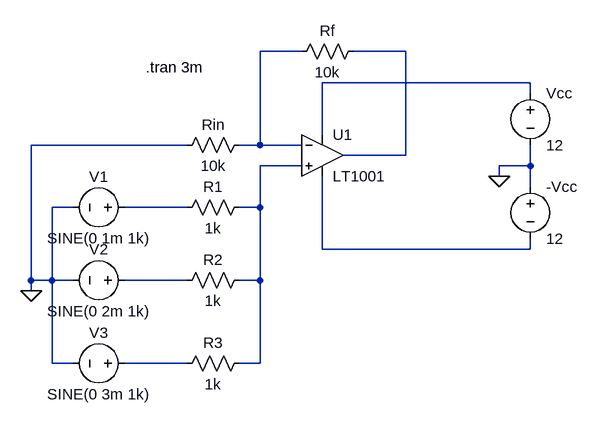
[diagram p0: schematic non_inverting_summing_amp.asc]
non_inverting_summing_amp.asc, the LTspice schematic file:
Version 4.1
SHEET 1 880 680
WIRE 144 0 80 0
WIRE 304 0 224 0
WIRE 496 48 176 48
WIRE 496 64 496 48
WIRE 176 128 176 48
WIRE -32 144 -272 144
WIRE 80 144 80 0
WIRE 80 144 48 144
WIRE 144 144 80 144
WIRE 304 160 304 0
WIRE 304 160 208 160
WIRE 144 176 80 176
WIRE 496 176 496 144
WIRE 496 176 448 176
WIRE 448 192 448 176
WIRE 496 208 496 176
WIRE -208 240 -240 240
WIRE -32 240 -128 240
WIRE 80 240 80 176
WIRE 80 240 48 240
WIRE 176 304 176 192
WIRE 496 304 496 288
WIRE 496 304 176 304
WIRE -272 352 -272 144
WIRE -240 352 -240 240
WIRE -240 352 -272 352
WIRE -208 352 -240 352
WIRE -32 352 -128 352
WIRE 80 352 80 240
WIRE 80 352 48 352
WIRE -272 368 -272 352
WIRE -240 480 -240 352
WIRE -208 480 -240 480
WIRE -32 480 -128 480
WIRE 80 480 80 352
WIRE 80 480 48 480
FLAG 448 192 0
FLAG -272 368 0
SYMBOL OpAmps\\LT1001 176 96 R0
SYMATTR InstName U1
SYMBOL voltage 496 48 R0
WINDOW 123 0 0 Left 0
WINDOW 39 0 0 Left 0
SYMATTR InstName Vcc
SYMATTR Value 12
SYMBOL voltage 496 192 R0
WINDOW 123 0 0 Left 0
WINDOW 39 0 0 Left 0
SYMATTR InstName -Vcc
SYMATTR Value 12
SYMBOL res 64 128 R90
WINDOW 0 0 56 VBottom 2
WINDOW 3 32 56 VTop 2
SYMATTR InstName Rin
SYMATTR Value 10k
SYMBOL res 240 -16 R90
WINDOW 0 0 56 VBottom 2
WINDOW 3 32 56 VTop 2
SYMATTR InstName Rf
SYMATTR Value 10k
SYMBOL voltage -112 240 R90
WINDOW 0 -32 56 VBottom 2
WINDOW 3 32 56 VTop 2
WINDOW 123 0 0 Left 0
SYMATTR InstName V1
SYMATTR Value SINE(0 1m 1k)
SYMBOL res 64 224 R90
WINDOW 0 0 56 VBottom 2
WINDOW 3 32 56 VTop 2
SYMATTR InstName R1
SYMATTR Value 1k
SYMBOL res 64 336 R90
WINDOW 0 0 56 VBottom 2
WINDOW 3 32 56 VTop 2
SYMATTR InstName R2
SYMATTR Value 1k
SYMBOL res 64 464 R90
WINDOW 0 0 56 VBottom 2
WINDOW 3 32 56 VTop 2
SYMATTR InstName R3
SYMATTR Value 1k
SYMBOL voltage -112 352 R90
WINDOW 0 -32 56 VBottom 2
WINDOW 3 32 56 VTop 2
WINDOW 123 0 0 Left 0
WINDOW 39 0 0 Left 0
SYMATTR InstName V2
SYMATTR Value SINE(0 2m 1k)
SYMBOL voltage -112 480 R90
WINDOW 0 -32 56 VBottom 2
WINDOW 3 32 56 VTop 2
WINDOW 123 0 0 Left 0
WINDOW 39 0 0 Left 0
SYMATTR InstName V3
SYMATTR Value SINE(0 3m 1k)
TEXT -96 24 Left 2 !.tran 3m

The netlist it stands for:
* non_inverting_summing_amp.asc
X§U1 N004 N001 N003 N006 N002 LT1001  ; pins In+ In- V+ V- OUT
Vcc N003 0 12
V§-Vcc 0 N006 12
Rin N001 0 10k
Rf N002 N001 10k
V1 N005 0 SINE(0 1m 1k)
R1 N004 N005 1k
R2 N004 N007 1k
R3 N004 N008 1k
V2 N007 0 SINE(0 2m 1k)
V3 N008 0 SINE(0 3m 1k)
.tran 3m
.lib LTC.lib
.backanno
.end